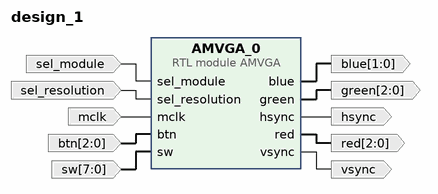
[diagram p0: block diagram of the top level]
# Vivado block design design_1, xczu7ev-ffvc1156-2-e, Vivado 2019.1
create_bd_design design_1

create_bd_port -dir I mclk
create_bd_port -dir I -from 2 -to 0 btn
create_bd_port -dir O hsync
create_bd_port -dir O vsync
create_bd_port -dir O -from 2 -to 0 red
create_bd_port -dir O -from 2 -to 0 -type data green
create_bd_port -dir O -from 1 -to 0 -type data blue
create_bd_port -dir I sel_module
create_bd_port -dir I sel_resolution
create_bd_port -dir I -from 7 -to 0 sw

create_bd_cell -type module -reference AMVGA AMVGA_0

# ---- connections ----

connect_bd_net [get_bd_ports sel_module] [get_bd_pins AMVGA_0/sel_module]
connect_bd_net [get_bd_ports sel_resolution] [get_bd_pins AMVGA_0/sel_resolution]
connect_bd_net [get_bd_ports mclk] [get_bd_pins AMVGA_0/mclk]
connect_bd_net [get_bd_ports btn] [get_bd_pins AMVGA_0/btn]
connect_bd_net [get_bd_ports sw] [get_bd_pins AMVGA_0/sw]
connect_bd_net [get_bd_pins AMVGA_0/hsync] [get_bd_ports hsync]
connect_bd_net [get_bd_pins AMVGA_0/vsync] [get_bd_ports vsync]
connect_bd_net [get_bd_pins AMVGA_0/red] [get_bd_ports red]
connect_bd_net [get_bd_pins AMVGA_0/green] [get_bd_ports green]
connect_bd_net [get_bd_pins AMVGA_0/blue] [get_bd_ports blue]

validate_bd_design
save_bd_design
